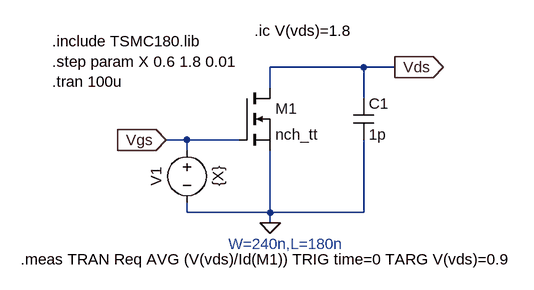
[diagram p0: schematic Prob_1a.asc]
Prob_1a.asc, the LTspice schematic file:
Version 4
SHEET 1 1360 680
WIRE 240 80 96 80
WIRE 288 80 240 80
WIRE 96 112 96 80
WIRE 240 128 240 80
WIRE -32 192 -64 192
WIRE 48 192 -32 192
WIRE -32 208 -32 192
WIRE -32 304 -32 288
WIRE 96 304 96 208
WIRE 96 304 -32 304
WIRE 240 304 240 192
WIRE 240 304 96 304
WIRE 96 320 96 304
FLAG -64 192 Vgs
IOPIN -64 192 In
FLAG 96 320 0
FLAG 288 80 Vds
IOPIN 288 80 Out
SYMBOL nmos 48 112 R0
SYMATTR InstName M1
SYMATTR Value nch_tt
SYMATTR Value2 W=240n,L=180n
SYMBOL voltage -32 192 R0
WINDOW 0 -32 56 VBottom 2
WINDOW 3 32 56 VTop 2
WINDOW 123 0 0 Left 0
WINDOW 39 0 0 Left 0
SYMATTR InstName V1
SYMATTR Value {X}
SYMBOL cap 224 128 R0
SYMATTR InstName C1
SYMATTR Value 1p
SYMATTR SpiceLine IC=1.8
TEXT -240 40 Left 2 !.include TSMC180.lib\n.step param X 0.6 1.8 0.01\n.tran 100u
TEXT 72 24 Left 2 !.ic V(vds)=1.8
TEXT -288 376 Left 2 !.meas TRAN Req AVG (V(vds)/Id(M1)) TRIG time=0 TARG V(vds)=0.9
TEXT 32 352 Left 2 ;W=240n,L=180n

The netlist it stands for:
* Prob_1a.asc
M1 Vds Vgs 0 0 nch_tt W=240n,L=180n
V1 Vgs 0 {X}
C1 Vds 0 1p IC=1.8
.model NMOS NMOS
.model PMOS PMOS
.lib standard.mos
.include TSMC180.lib
.step param X 0.6 1.8 0.01
.tran 100u
.ic V(vds)=1.8
.meas TRAN Req AVG (V(vds)/Id(M1)) TRIG time=0 TARG V(vds)=0.9
* W=240n,L=180n
.backanno
.end

* Results of the author's LTspice run, read from the files saved beside the schematic
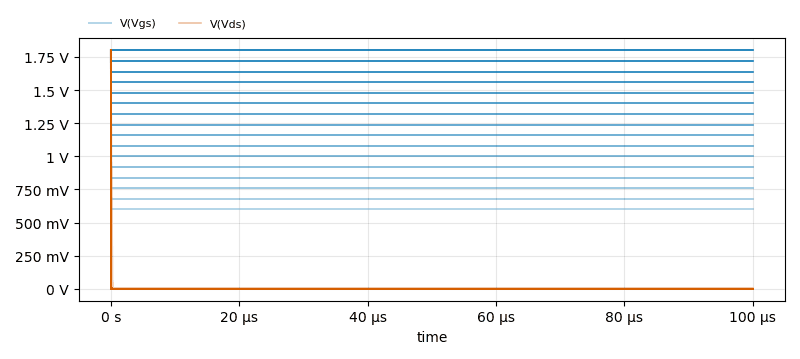
[diagram p1: Transient Analysis of Prob_1a.asc, plotted from the saved traces]
* Transient Analysis, 121 runs:
*   V(Vgs) [run 1]: min 600 mV, max 600 mV, average 600 mV, rms 600 mV, last 600 mV
*   V(Vgs) [run 2]: min 680 mV, max 680 mV, average 680 mV, rms 680 mV, last 680 mV
*   V(Vgs) [run 3]: min 760 mV, max 760 mV, average 760 mV, rms 760 mV, last 760 mV
*   V(Vgs) [run 4]: min 840 mV, max 840 mV, average 840 mV, rms 840 mV, last 840 mV
*   V(Vgs) [run 5]: min 920 mV, max 920 mV, average 920 mV, rms 920 mV, last 920 mV
*   V(Vgs) [run 6]: min 1 V, max 1 V, average 1 V, rms 1 V, last 1 V
*   V(Vgs) [run 7]: min 1.08 V, max 1.08 V, average 1.08 V, rms 1.08 V, last 1.08 V
*   V(Vgs) [run 8]: min 1.16 V, max 1.16 V, average 1.16 V, rms 1.16 V, last 1.16 V
*   V(Vds) [run 1]: min 0 V, max 1.8 V, average 2.324 mV, rms 51.87 mV, last 0 V
*   V(Vds) [run 2]: min 0 V, max 1.8 V, average 1.129 mV, rms 36.43 mV, last 0 V
*   V(Vds) [run 3]: min 0 V, max 1.8 V, average 694 µV, rms 28.73 mV, last 0 V
*   V(Vds) [run 4]: min 0 V, max 1.8 V, average 479.1 µV, rms 23.75 mV, last 0 V
*   V(Vds) [run 5]: min 0 V, max 1.8 V, average 369.4 µV, rms 20.96 mV, last 0 V
*   V(Vds) [run 6]: min 0 V, max 1.8 V, average 290.9 µV, rms 18.47 mV, last 0 V
*   V(Vds) [run 7]: min 0 V, max 1.8 V, average 241.2 µV, rms 16.84 mV, last 0 V
*   V(Vds) [run 8]: min 0 V, max 1.8 V, average 206.9 µV, rms 15.64 mV, last 0 V
* From the log:
*   Measurement: req
*     step  AVG(v(vds)/id(m1))  FROM  TO
*        1  169674  0  1.20368e-007
*        2  152733  0  1.09256e-007
*        3  138328  0  9.94294e-008
*        4  125871  0  8.9535e-008
*        5  115176  0  8.18454e-008
*        6  105904  0  7.51711e-008
*        7  97829.5  0  6.92868e-008
*        8  90886.9  0  6.39656e-008
*        9  84476.2  0  5.91998e-008
*       10  78828.8  0  5.49773e-008
*       11  73807.4  0  5.14681e-008
*       12  69312.1  0  4.83689e-008
*       13  65274.8  0  4.55909e-008
*       14  61637.3  0  4.30869e-008
*       15  58343.2  0  4.08392e-008
*       16  55347  0  3.87858e-008
*       17  52624.2  0  3.68294e-008
*       18  50148.5  0  3.5081e-008
*       19  47906.2  0  3.35049e-008
*       20  45759.6  0  3.14623e-008
*       21  43786.1  0  3.00579e-008
*       22  41962.3  0  2.87998e-008
*       23  40270.7  0  2.76489e-008
*       24  38698  0  2.65843e-008
*       25  37233.1  0  2.55948e-008
*       26  35865.5  0  2.46744e-008
*       27  34587.5  0  2.38135e-008
*       28  33391.1  0  2.30089e-008
*       29  32268.9  0  2.22561e-008
*       30  31213.8  0  2.15501e-008
*       31  30217.4  0  2.08936e-008
*       32  29277.3  0  2.02708e-008
*       33  28389.5  0  1.96754e-008
*       34  27553.2  0  1.9101e-008
*       35  26765  0  1.8569e-008
*       36  26021.9  0  1.80744e-008
*       37  25277.2  0  1.73581e-008
*       38  24595.9  0  1.67969e-008
*       39  23953.3  0  1.6294e-008
*       40  23337.8  0  1.58448e-008
*     ...